# EAGLE design motion_detect (EAGLE 7.7.0)
Assembly variants: BASIC
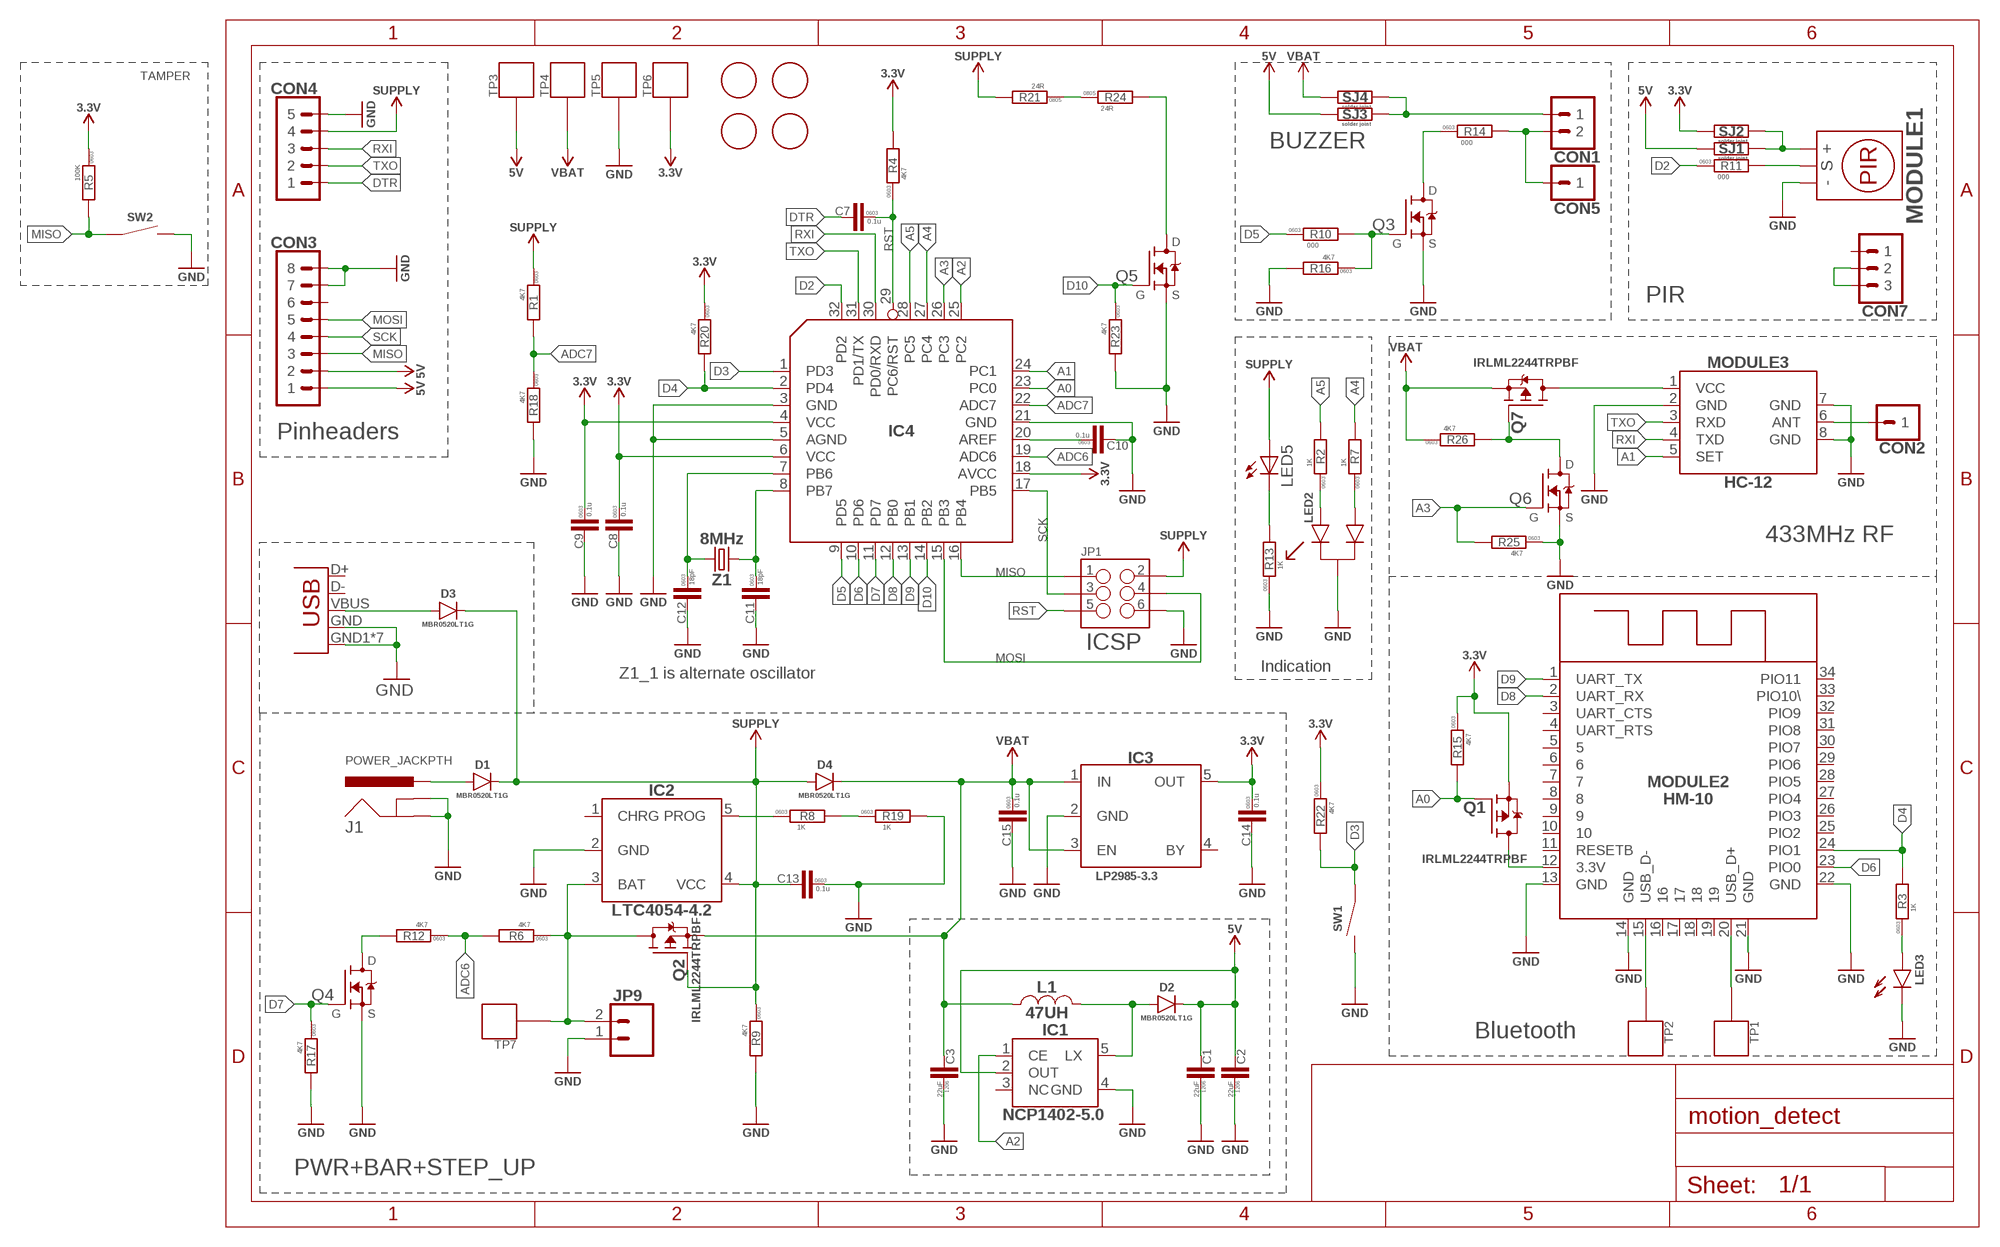
[diagram p0: schematic, sheet 1]

## Parts
C1  22uF  C-1206  [C1206]
C2  22uF  C-1206  [C1206]
C3  22uF  C-1206  [C1206]
C7  0.1u  C-0603  [C0603]
C8  0.1u  C-0603  [C0603]
C9  0.1u  C-0603  [C0603]
C10  0.1u  C-0603  [C0603]
C11  18pF  C-0603  [C0603]
C12  18pF  C-0603  [C0603]
C13  0.1u  C-0603  [C0603]
C14  0.1u  C-0603  [C0603]
C15  0.1u  C-0603  [C0603]
CON1  PINHEAD_1X02-2.54  [1X02-PTH-2.54]
CON2  PINHEAD_1X01-2.54  [1X01-PTH-2.54]
CON3  PINHEAD_1X08-2.54  [1X08-PTH-2.54]
CON4  PINHEAD_1X05-2.54  [1X05-PTH-2.54]
CON5  PINHEAD_1X01-2.54  [1X01-PTH-2.54]
CON7  PINHEAD_1X03-2.54  [1X03-PTH-2.54]
CON8  USB-1  [MICRO_USB_WITH_PEGS]
D1  MBR0520L-SOD123  [SOD123]
D2  MBR0520L-SOD123  [SOD123]
D3  MBR0520L-SOD123  [SOD123]
D4  MBR0520L-SOD123  [SOD123]
IC1  5.0  NCP1402-5V  [SOT23-5]
IC2  LTC4054  [SOT23-5L]
IC3  3.3  LP2985-3.3V  [SOT23-5L]
IC4  ATMEGA168-TQFP32  [TQFP32-08]
J1  POWER_JACKPTH  [POWER_JACK_PTH]
JP1  M03X2POGO_PINS  [2X3_POGO]
JP9  M02-B2B-PH-K-S  [JST-2-PTH]
L1  47UH  INDUCTOR-SDR0403  [SDR0403]
LED2  BL-L315EGW  [BL-L315]
LED3  LED-0603  [LED0603]
LED5  LED-3MM  [LED-3MM]
MODULE1  MOTION-PIR-DYP-ME003  [MOTION-PIR-DYP-ME003]
MODULE2  HM-10  [HM-10]
MODULE3  HC12  [HC-12]
Q1  IRLML2244TRPBF  [SOT23B-3]
Q2  IRLML2244TRPBF  [SOT23B-3]
Q3  IRLML2502-SOT23  [SOT23B-3]
Q4  IRLML2502-SOT23  [SOT23B-3]
Q5  IRLML2502-SOT23  [SOT23B-3]
Q6  IRLML2502-SOT23  [SOT23B-3]
Q7  IRLML2244TRPBF  [SOT23B-3]
R1  4K7  R-0603  [R0603]
R2  1K  R-0603  [R0603]
R3  1K  R-0603  [R0603]
R4  4K7  R-0603  [R0603]
R5  100K  R-0603  [R0603]
R6  4K7  R-0603  [R0603]
R7  1K  R-0603  [R0603]
R8  1K  R-0603  [R0603]
R9  4K7  R-0603  [R0603]
R10  000  R-0603  [R0603]
R11  000  R-0603  [R0603]
R12  4K7  R-0603  [R0603]
R13  1K  R-0603  [R0603]
R14  000  R-0603  [R0603]
R15  4K7  R-0603  [R0603]
R16  4K7  R-0603  [R0603]
R17  4K7  R-0603  [R0603]
R18  4K7  R-0603  [R0603]
R19  1K  R-0603  [R0603]
R20  4K7  R-0603  [R0603]
R21  24R  R-0805  [R0805]
R22  4K7  R-0603  [R0603]
R23  4K7  R-0603  [R0603]
R24  24R  R-0805  [R0805]
R25  4K7  R-0603  [R0603]
R26  4K7  R-0603  [R0603]
SJ1  SOLDER_JOINT  [RES_0]  (not fitted in variant BASIC)
SJ2  SOLDER_JOINT  [RES_0]  (not fitted in variant BASIC)
SJ3  SOLDER_JOINT  [RES_0]  (not fitted in variant BASIC)
SJ4  SOLDER_JOINT  [RES_0]  (not fitted in variant BASIC)
SW1  TACT_SWITCH-TC-206  [TC-0206]
SW2  TACT_SWITCH  [FSM8JH]
TP1  PAD.05  [PAD.05X.05]  (not fitted in variant BASIC)
TP2  PAD.05  [PAD.05X.05]  (not fitted in variant BASIC)
TP3  PAD.05  [PAD.05X.05]  (not fitted in variant BASIC)
TP4  PAD.05  [PAD.05X.05]  (not fitted in variant BASIC)
TP5  PAD.05  [PAD.05X.05]  (not fitted in variant BASIC)
TP6  PAD.05  [PAD.05X.05]  (not fitted in variant BASIC)
TP7  PAD.05  [PAD.05X.05]  (not fitted in variant BASIC)
U$3  FIDUCIALMOUNT  [FIDUCIA-MOUNT]  (not fitted in variant BASIC)
U$4  FIDUCIALMOUNT  [FIDUCIA-MOUNT]  (not fitted in variant BASIC)
U$5  FIDUCIALMOUNT  [FIDUCIA-MOUNT]  (not fitted in variant BASIC)
U$6  FIDUCIALMOUNT  [FIDUCIA-MOUNT]  (not fitted in variant BASIC)
Z1  8MHz  CRYSTAL-8MHZHC49UP  [HC49UP]

## Nets
A0: IC4.23(PC0) Q1.1(G) R15.2
A1: IC4.24(PC1) MODULE3.5(SET)
A2: IC1.1(CE) IC4.25(PC2)
A3: IC4.26(PC3) Q6.1(G) R25.2
A4: IC4.27(PC4) R7.2
A5: IC4.28(PC5) R2.2
ADC6: IC4.19(ADC6) R6.2 R12.1
ADC7: IC4.22(ADC7) R1.2 R18.1
ANT: CON2.1 MODULE3.6(ANT)
BAT+: IC2.3(BAT) JP9.2 Q2.3(D) R6.1 TP7.P$1
D2: IC4.32(PD2) R11.1
D3: IC4.1(PD3) R22.2 SW1.1
D4: IC4.2(PD4) MODULE2.24(PIO1) R3.2 R20.2
D5: IC4.9(PD5) R10.1
D6: IC4.10(PD6) MODULE2.23(PIO0)
D7: IC4.11(PD7) Q4.1(G) R17.1
D8: IC4.12(PB0) MODULE2.2(UART_RX)
D9: IC4.13(PB1) MODULE2.1(UART_TX)
D10: IC4.14(PB2) Q5.1(G) R23.1
DTR: C7.2 CON4.1
GND: C1.P$1 C2.P$1 C3.P$1 C8.2 C9.2 C10.2 C11.2 C12.2 C13.1 C14.2 C15.2 CON3.7 CON3.8 CON4.5 CON8.GND CON8.GND1(SHIELD) CON8.GND2(SHIELD) CON8.GND3(SHIELD) CON8.GND4(SHIELD) CON8.ID(SHIELD) CON8.P$1(SHIELD) CON8.P$2(SHIELD) IC1.4(GND) IC2.2(GND) IC3.2(GND) IC4.3(GND) IC4.5(AGND) IC4.21(GND) J1.GND J1.GNDBREAK JP1.P$6 JP9.1 LED2.C LED3.C MODULE1.1(GND) MODULE2.13(GND) MODULE2.14(GND) MODULE2.21(GND) MODULE2.22(GND) MODULE3.2(GND) MODULE3.7(GND) MODULE3.8(GND) Q3.2(S) Q4.2(S) Q5.2(S) Q6.2(S) R9.2 R13.1 R16.2 R17.2 R18.2 R19.2 R23.2 R25.1 SW1.2 SW2.3 SW2.4 TP5.P$1
MISO: CON3.3 IC4.16(PB4) JP1.P$1 R5.2 SW2.1 SW2.2
MOSI: CON3.5 IC4.15(PB3) JP1.P$4
N$1: MODULE2.12(3.3V) Q1.3(D)
N$2: LED2.AG(A) R2.1
N$3: LED3.A R3.1
N$4: C10.1 IC4.20(AREF)
N$5: D2.A IC1.5(LX) L1.P$2
N$6: C12.1 IC4.7(PB6) Z1.2
N$7: R8.2 R19.1
N$8: C11.1 IC4.8(PB7) Z1.1
N$9: IC2.5(PROG) R8.1
N$10: CON8.VBUS D3.A
N$11: MODULE1.2(OUT) R11.2
N$12: LED5.K(C) R13.2
N$13: D1.A J1.PWR
N$14: CON7.2 CON7.3
N$15: Q3.1(G) R10.2 R16.1
N$16: MODULE2.15(USB_D-) TP2.P$1
N$17: MODULE1.3(VCC) SJ1.2 SJ2.2
N$18: MODULE2.20(USB_D+) TP1.P$1
N$19: R21.1 R24.1
N$20: Q3.3(D) R14.1
N$21: Q4.3(D) R12.2
N$22: CON1.1 SJ3.2 SJ4.2
N$23: CON1.2 CON5.1 R14.2
N$24: MODULE3.1(VCC) Q7.3(D)
N$25: Q5.3(D) R24.2
N$26: LED2.AR(A1) R7.1
N$27: Q6.3(D) Q7.1(G) R26.2
RST: C7.1 IC4.29(PC6/RST) JP1.P$5 R4.1
RXI: CON4.3 IC4.30(PD0/RXD) MODULE3.4(TXD)
SCK: CON3.4 IC4.17(PB5) JP1.P$3
SUP: C13.2 CON4.4 D1.C D3.C D4.A IC2.4(VCC) JP1.P$2 LED5.A Q2.1(G) R1.1 R9.1 R21.2 ; supply symbol labelled SUPPLY
TXO: CON4.2 IC4.31(PD1/TX) MODULE3.3(RXD)
VBAT: C3.P$2 C15.1 D4.C IC3.1(IN) IC3.3(EN) L1.P$1 Q2.2(S) Q7.2(S) R26.1 SJ4.1 TP4.P$1
VDD_3V3: C8.1 C9.1 C14.1 IC3.5(OUT) IC4.4(VCC) IC4.6(VCC) IC4.18(AVCC) Q1.2(S) R4.2 R5.1 R15.1 R20.1 R22.1 SJ2.1 TP6.P$1 ; supply symbol labelled 3.3V
VDD_5V: C1.P$2 C2.P$2 CON3.1 CON3.2 D2.C IC1.2(OUT) SJ1.1 SJ3.1 TP3.P$1 ; supply symbol labelled 5V
Unconnected: CON3.6 CON7.1 CON8.D+ CON8.D- IC1.3(NC) IC2.1(CHRG) IC3.4(BY) MODULE2.3(UART_CTS) MODULE2.4(UART_RTS) MODULE2.5 MODULE2.6 MODULE2.7 MODULE2.8 MODULE2.9 MODULE2.10 MODULE2.11(RESETB) MODULE2.16 MODULE2.17 MODULE2.18 MODULE2.19 MODULE2.25(PIO2) MODULE2.26(PIO3) MODULE2.27(PIO4) MODULE2.28(PIO5) MODULE2.29(PIO6) MODULE2.30(PIO7) MODULE2.31(PIO8) MODULE2.32(PIO9) MODULE2.33(PIO10\) MODULE2.34(PIO11)

## Notes on the sheet
- TAMPER
- BUZZER
- PIR
- Pinheaders
- 433MHz RF
- ICSP
- Indication
- Z1_1 is alternate oscillator
- Bluetooth
- PWR+BAR+STEP_UP

## Library data of the parts
C1-C3 = rc:C; PACKAGE: 1206
C7-C15 = rc:C; PACKAGE: 0603
CON1 = pinhead:PINHEAD_1X02: pinheader 2P
CON2 CON5 = pinhead:PINHEAD_1X01: pinheader 1P; BOM: EXCLUDE
CON3 = pinhead:PINHEAD_1X08: pinheader 8P
CON4 = pinhead:PINHEAD_1X05: pinheader 5P
CON7 = pinhead:PINHEAD_1X03: pinheader 3P
CON8 = led_matrix_master_lib:USB: Connector Receptacle USB - micro B 2.0 5 Position; DIGIKEY#: 609-4616-1-ND; LINK: https://www.compel.ru/infosheet/TE/2013499-1; MANF: FCI; MANF#: 10118193-0001LF
D1-D4 = motion_detect_masterlib:MBR0520L: DIODE SCHOTTKY 20V 500MA SOD123; DIGIKEY#: MBR0520LT1GOSTR-ND; MANF: ON Semiconductor; MANF#: MBR0520LT1G
IC1 = motion_detect_masterlib:NCP1402: IC REG BOOST 5V 0.13A 5TSOP; DIGIKEY#: NCP1402SN50T1GOSCT-ND; LINK: https://www.chipdip.ru/product/ncp1402sn50t1g; MANF: ON Semiconductor; MANF#: NCP1402SN50T1G
IC2 = gradus_mater_lib:LTC4054: IC CHARG BATTERY L-ION TSOT23-5; DIGIKEY#: LTC4054LES5-4.2#TRPBFCT-ND; MANF: Linear Technology; MANF#: LTC4054LES5-4.2#TRPBF
IC3 = motion_detect_masterlib:LP2985-3.3V: IC REG LDO 3.3V 0.15A SOT23-5; DIGIKEY#: 296-18476-1-ND; MANF: Texas Instruments; MANF#: LP2985-33DBVR
IC4 = motion_detect_masterlib:ATMEGA168; MANF#: ATMEGA168
J1 = SparkFun-Connectors:POWER_JACK: Power Jack This is the standard 5.5mm barrel jack for power. The PTH is the most common, proven, reliable, footprint. The Slot footprint only works if the mill layer is transmitted to the PCB fab house so be warned. Spark Fun Electronics SKU : PRT-00119 SMT: CONN-08106 Mating wall wart : TOL-00298 (and others)
JP1 = SparkFun-Connectors:M03X2: 2x3 .1" header. Shrouded, with keying- CONN-10681 SMT- CONN-11415 Pogo pins- HW-11044; PROD_ID: HW-11044
JP9 = ExitControl_v2_master_library:M02: Header 2 Standard 2-pin 0.1" header. Use with straight break away headers (SKU : PRT-00116), right angle break away headers (PRT-00553), swiss pins (PRT-00743), machine pins (PRT-00117), and female headers (PRT-00115). Molex polarized connector foot print use with SKU : PRT-08233 with associated crimp pins and housings.; COMPEL: http://www.compel.ru/infosheet/JST/B2B-PH-K-S%5BLF%5D%5BSN%5D/; DIGIKEY#: 455-1704-ND; MANF: B2B-PH-K-S(LF)(SN); MANF#: JST Sales America Inc
L1 = motion_detect_masterlib:INDUCTOR: Unshielded Wirewound Inductor; LINK: https://www.chipdip.ru/product/sdr0403-470k
LED2 = motion_detect_masterlib:BL-L315EGW
LED3 = rc:LED: SMD LED; ASSY: DNM; COLOR: blue
LED5 = dp_devices:LED: Light Emitting Diode; COLOR: RED
MODULE1 = diy-modules:MOTION-PIR-DYP-ME003: PIR Motion Sensor Module DYP-ME003 based on BISS0001 pyroelectic detector Click here to find device on ebay.com <http://www.ebay.com/sch/dyp+me003>
MODULE2 = motion_detect_masterlib:HM-10
MODULE3 = motion_detect_masterlib:HC12
Q1 Q2 Q7 = motion_detect_masterlib:IRLML2244TRPBF: MOSFET P-CH 20V 4.3A SOT23; DIGIKEY#: IRLML2244TRPBFCT-ND; LINK: https://www.chipdip.ru/product/irlml2244trpbf; MANF: Infineon Technologies; MANF#: IRLML2244TRPBF
Q3-Q6 = motion_detect_masterlib:IRLML2502: MOSFET N-CH 20V 4.2A SOT-23; DIGIKEY#: IRLML2502PBFTR-ND; MANF: Infineon Technologies; MANF#: IRLML2502TRPBF
R1 R2 R6-R19 R23 R25 R26 = rc:R; PACKAGE: 0603
R3-R5 R20 R22 = rc:R; ASSY: DNM; PACKAGE: 0603
R21 R24 = rc:R; PACKAGE: 0805
SJ1-SJ4 = eth_conv_master_lib:SOLDER_JOINT; ASSY: DNM; BOM: EXCLUDE
SW1 SW2 = motion_detect_masterlib:TACT_SWITCH
TP1-TP7 = pixhawk2:PAD: Test pad This footprint includes three classes: The actual test pads, a pogo-pin footprint to mount the pogo-pin as through-hole part and a hole footprint which allows the head of the pogo-pin to pass through (do NOT use the hole to mount the pogo-pin). In a typical test setup, the stack would consist of three PCBs: The actual PCB under testing with a test pad on the bottom, then a second PCB with the hole for the pogo-pin head where the PCB under testing is pressed on and a third PCB at 30 mm / 1.2" distance with the pogo-pin footprints. The pogo-pins are soldered to the last PCB. To create the stack, copy the board under testing and exchange the footprints - this way the correct positioning is ensured.; BOM: EXCLUDE; PARTNO: *
U$3-U$6 = eth_conv_master_lib:FIDUCIALMOUNT; BOM: EXCLUDE
Z1 = ExitControl_v2_master_library:CRYSTAL-8MHZ: Crystal 8.0000MHz 30ppm 18pF 40 Ohm -20°C - 70°C Surface Mount HC49/US; DIGIKEY#: 535-10212-1-ND; MANF: Abracon LLC; MANF#: ABLS-8.000MHZ-B4-T

## Net classes
1 vcc: width 0.254 mm

## Board
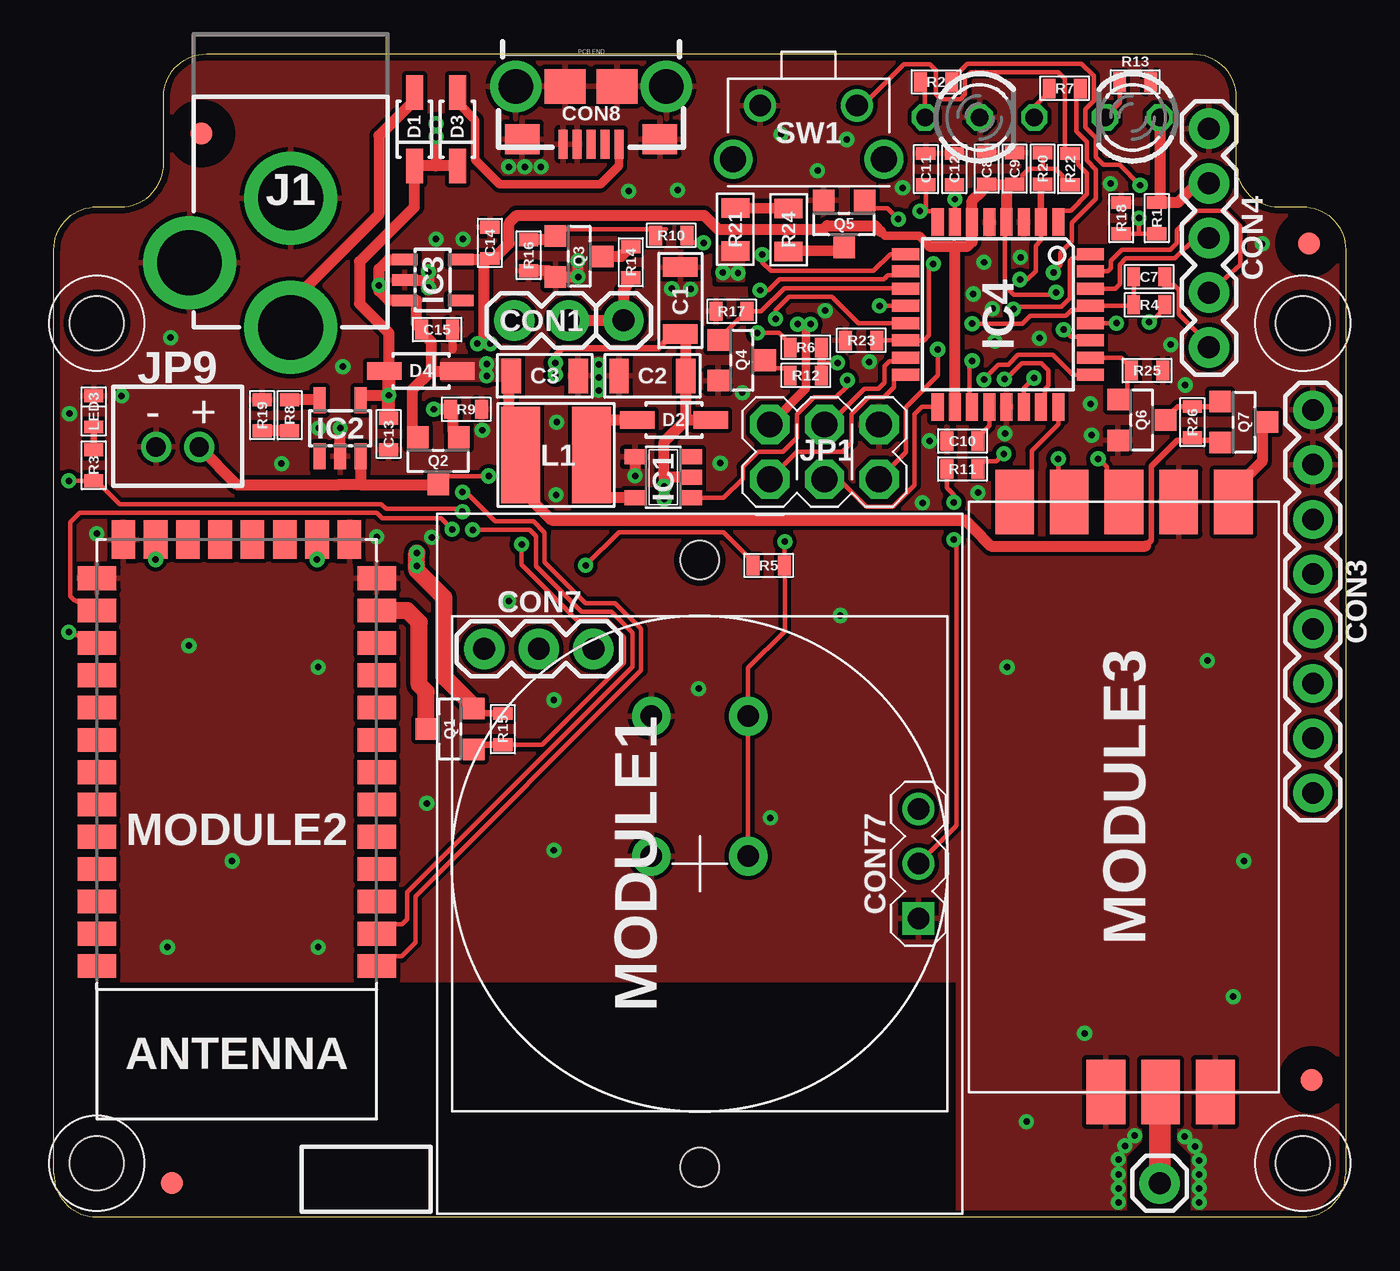
[diagram p1: board, top side]
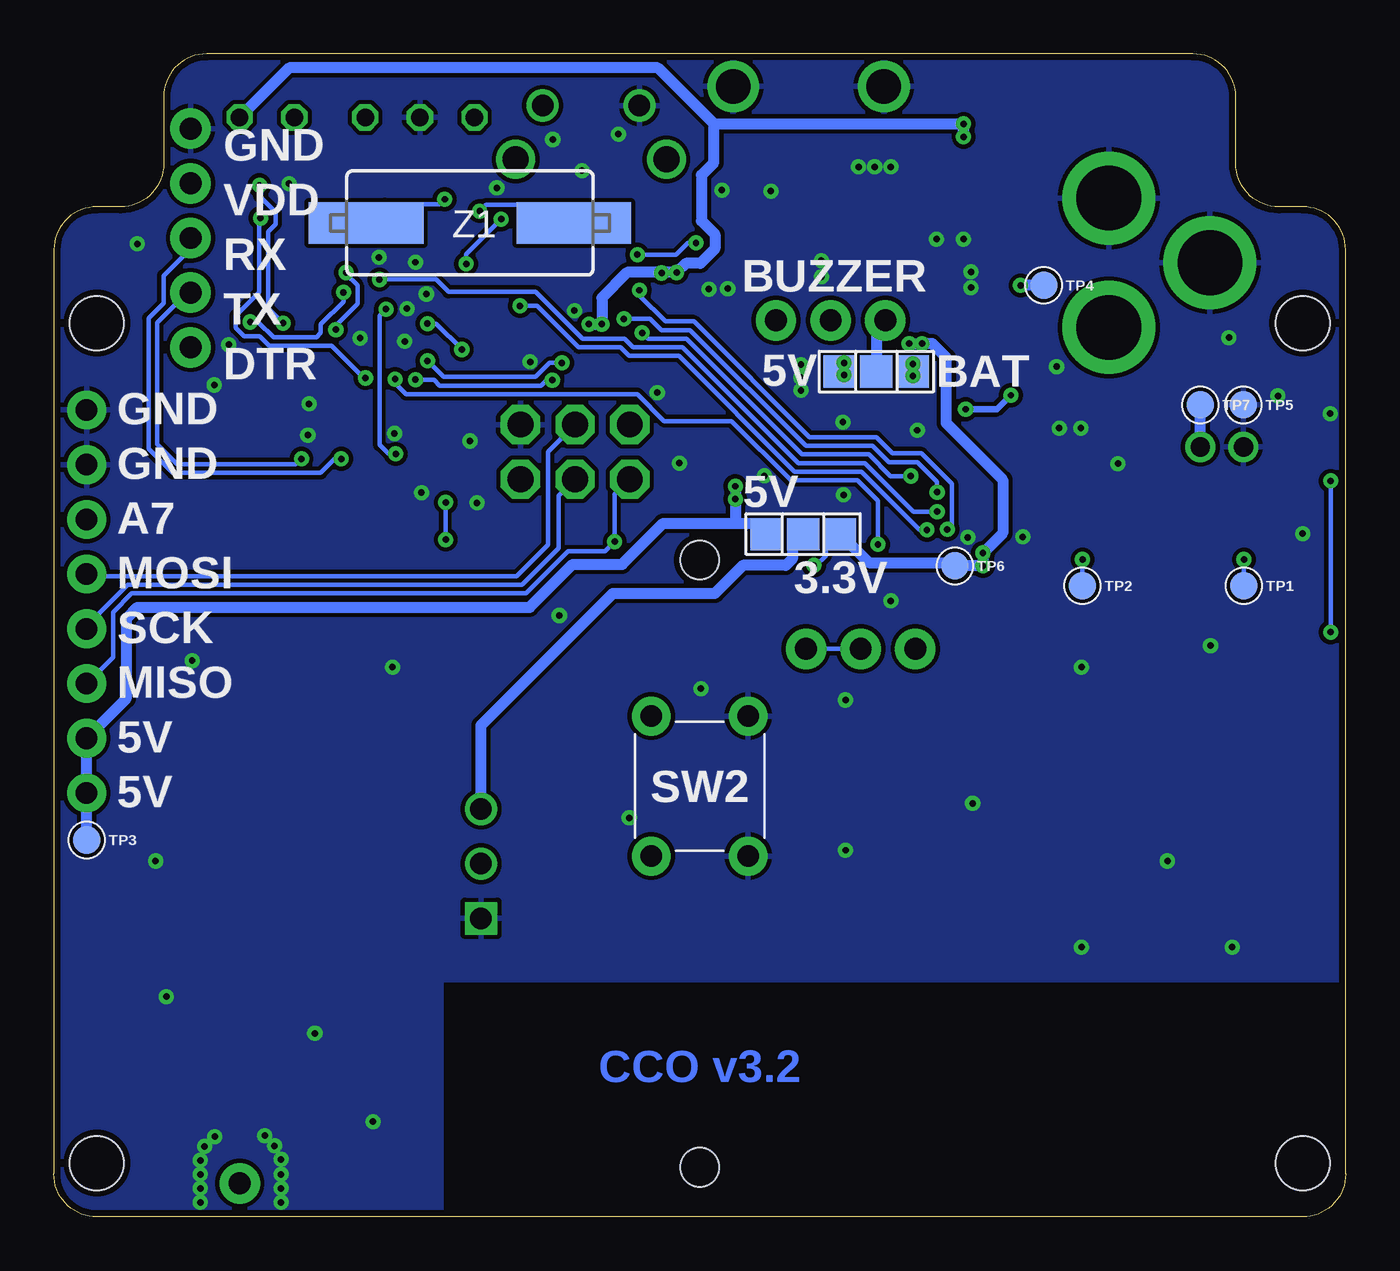
[diagram p2: board, bottom side, seen from below]

Size 60 x 54 mm. Coordinates in mm from the lower left corner, seen from the top.
Copper layers (1*16): Top 0.035mm / dielectric 0.5mm / Bottom 0.035mm
Design rules "design_rules *": minimum track width 0.2mm, minimum drill 0.2mm, track to track 0.2mm, track to pad 0.2mm, pad to pad 0.2mm, via to via 0.2mm, smd to smd 0.15mm, copper to edge 0.3mm, drill to drill 0.2mm, minimum pad ring 0.125mm, minimum via ring 0.125mm, stop-mask expansion 1mil, vias tented up to drill 0.31mm, thermal gap 8mil
tRestrict: 8 lines

### Footprints (pad centres in the part's own frame; a part is rotated, then mirrored left to right if it is on the bottom)
C1206 = smd 0.9 x 1.6: P$1 -1.55,0; P$2 1.55,0
C0603 = smd 0.6 x 0.9: 1 -0.725,0; 2 0.725,0
1X02-PTH-2.54 = drill 1.016 pad 1.88: 1 -1.27,0; 2 1.27,0
1X01-PTH-2.54 = drill 1.016 pad 1.88: 1 0,0
1X08-PTH-2.54 = drill 1 pad 1.8: 1 -8.89,0; 2 -6.35,0; 3 -3.81,0; 4 -1.27,0; 5 1.27,0; 6 3.81,0; 7 6.35,0; 8 8.89,0
1X05-PTH-2.54 = drill 1.016 pad 1.88: 1 -5.08,0; 2 -2.54,0; 3 0,0; 4 2.54,0; 5 5.08,0
1X03-PTH-2.54 = drill 1.016 pad 1.88: 1 -2.54,0; 2 0,0; 3 2.54,0
MICRO_USB_WITH_PEGS = smd 0.4 x 1.35: D+ 0,1.44; D- -0.65,1.44; GND 1.3,1.44; ID 0.65,1.44; VBUS -1.3,1.44 | smd 1.9 x 1.6: GND1 -1.2,-1.24; GND2 1.2,-1.24 | smd 1.6 x 1.4: GND3 -3.2,1.21; GND4 3.2,1.21 | drill 1.6 pad 2: P$1 -3.5,-1.24; P$2 3.5,-1.24
SOD123 = smd 1.6 x 0.8: A 1.7,0; C -1.7,0
SOT23-5 = smd 0.7 x 1: 1 -0.95,-1.3; 2 0,-1.3; 3 0.95,-1.3; 4 0.95,1.3; 5 -0.95,1.3
SOT23-5L = smd 0.55 x 1.2: 1 -0.95,-1.3; 2 0,-1.3; 3 0.95,-1.3; 4 0.95,1.3; 5 -0.95,1.3
TQFP32-08 = smd 1.27 x 0.559: 1 -4.293,2.8; 2 -4.293,2; 3 -4.293,1.2; 4 -4.293,0.4; 5 -4.293,-0.4; 6 -4.293,-1.2; 7 -4.293,-2; 8 -4.293,-2.8; 17 4.293,-2.8; 18 4.293,-2; 19 4.293,-1.2; 20 4.293,-0.4; 21 4.293,0.4; 22 4.293,1.2; 23 4.293,2; 24 4.293,2.8 | smd 0.559 x 1.27: 9 -2.8,-4.293; 10 -2,-4.293; 11 -1.2,-4.293; 12 -0.4,-4.293; 13 0.4,-4.293; 14 1.2,-4.293; 15 2,-4.293; 16 2.8,-4.293; 25 2.8,4.293; 26 2,4.293; 27 1.2,4.293; 28 0.4,4.293; 29 -0.4,4.293; 30 -1.2,4.293; 31 -2,4.293; 32 -2.8,4.293
POWER_JACK_PTH = drill 2.997 pad 4.318: GND 0,7.7; GNDBREAK 4.7,10.7; PWR 0,13.7
2X3_POGO = drill 1.2 pad 1.829 octagon: P$1 0,0; P$2 0,2.54; P$3 2.54,0; P$4 2.54,2.54; P$5 5.08,0; P$6 5.08,2.54
JST-2-PTH = drill 0.9 pad 1.4: 1 -1,0; 2 1,0
SDR0403 = smd 1.8 x 4.5: P$1 -1.65,0; P$2 1.65,0
BL-L315 = drill 0.813 octagon: AG -2.54,0; AR 2.54,0; C 0,0
LED0603 = smd 0.6 x 0.9: A -0.725,0; C 0.725,0
LED-3MM = drill 0.813 octagon: A -1.27,0; K 1.27,0
MOTION-PIR-DYP-ME003 = drill 1 square: 1 -2.54,-10.16 | drill 1: 2 0,-10.16; 3 2.54,-10.16 | hole 1.8: -14.1,0; 14.1,0
HM-10 = smd 1.8 x 1.1: 1 -6.5,6.35; 2 -6.5,4.85; 3 -6.5,3.35; 4 -6.5,1.85; 5 -6.5,0.35; 6 -6.5,-1.15; 7 -6.5,-2.65; 8 -6.5,-4.15; 9 -6.5,-5.65; 10 -6.5,-7.15; 11 -6.5,-8.65; 12 -6.5,-10.15; 13 -6.5,-11.65; 22 6.5,-11.65; 23 6.5,-10.15; 24 6.5,-8.65; 25 6.5,-7.15; 26 6.5,-5.65; 27 6.5,-4.15; 28 6.5,-2.65; 29 6.5,-1.15; 30 6.5,0.35; 31 6.5,1.85; 32 6.5,3.35; 33 6.5,4.85; 34 6.5,6.35 | smd 1.1 x 1.8: 14 -5.23,-13.45; 15 -3.73,-13.45; 16 -2.23,-13.45; 17 -0.73,-13.45; 18 0.77,-13.45; 19 2.27,-13.45; 20 3.77,-13.45; 21 5.27,-13.45
HC-12 = smd 3 x 1.8: 1 -13.7,5.08; 2 -13.7,2.54; 3 -13.7,0; 4 -13.7,-2.54; 5 -13.7,-5.08; 6 13.7,1.7; 7 13.7,4.24; 8 13.7,-0.84
SOT23B-3 = smd 1 x 1: 1 -0.95,-1.1; 2 0.95,-1.1; 3 0,1.1
R0603 = smd 0.6 x 0.9: 1 -0.725,0; 2 0.725,0
R0805 = smd 0.9 x 1.3: 1 -1,0; 2 1,0
RES_0 = smd 1.5 x 1.5: 1 -0.85,0; 2 0.85,0
TC-0206 = drill 1: 1 -2.25,-1.25; 2 2.25,-1.25 | drill 1.2: P$3 -3.5,1.25; P$4 3.5,1.25
FSM8JH = drill 1 pad 1.8: 1 2.25,3.25; 2 2.25,-3.25; 3 -2.25,3.25; 4 -2.25,-3.25
PAD.05X.05 = smd 1.27 x 1.27: P$1 0,0
BOARD_OUTLINE = hole 2.5: -28,-23.5; 28,-23.5; -28,15.5; 28,15.5
FIDUCIA-MOUNT = smd 1.016 x 1.016: P$1 0,0
HC49UP = smd 5.334 x 1.93: 1 -4.826,0; 2 4.826,0

### Placement (x,y rotation side)
C1  29.1,42.55 270 top
C2  27.8,39.05 0 top
C3  22.8,39.05 180 top
C7  50.88,43.65 0 top
C8  43.33,48.67 90 top
C9  44.62,48.67 90 top
C10  42.2,36.02 180 top
C11  40.5,48.65 90 top
C12  41.83,48.65 90 top
C13  15.55,36.35 90 top
C14  20.25,45.23 90 top
C15  17.8,41.2 0 top
CON1  22.65,41.62 0 top
CON2  51.36,1.56 0 top
CON3  58.48,28.57 90 top
CON4  53.65,45.45 90 top
CON5  26.46,41.62 0 top
CON7  22.52,26.38 0 top
CON8  24.95,51.25 180 top
D1  16.75,50.5 90 top
D2  28.8,37 180 top
D3  18.75,50.5 90 top
D4  17.05,39.27 180 top
IC1  28.3,34.34 90 top
IC2  13.3,36.62 0 top
IC3  17.6,43.5 270 top
IC4  43.85,41.9 270 top
J1  11,55 180 top
JP1  33.25,34.25 0 top
JP9  5.75,35.75 0 top
L1  23.32,35.38 0 top
LED2  43,51.05 0 top
LED3  1.85,37.4 90 top
LED5  50.1,51.05 180 top
MODULE1  30,16.4 90 top
MODULE2  8.5,18 180 top
MODULE3  49.7,19.5 270 top
Q1  18.4,22.65 90 top
Q2  17.85,35.1 180 top
Q3  24.4,44.6 270 top
Q4  31.95,39.77 270 top
Q5  36.7,46.1 180 top
Q6  50.52,37 270 top
Q7  55.27,36.9 270 top
R1  51.23,46.38 270 top
R2  40.98,52.7 0 top
R3  1.85,34.9 270 top
R4  50.88,42.35 0 top
R5  33.2,30.25 0 top
R6  34.92,40.38 0 top
R7  46.95,52.4 0 top
R8  10.95,37.23 270 top
R9  19.15,37.5 0 top
R10  28.68,45.58 180 top
R11  42.2,34.73 180 top
R12  34.92,39.08 180 top
R13  50.23,52.7 180 top
R14  26.8,44.33 270 top
R15  20.85,22.65 270 top
R16  22.05,44.65 270 top
R17  31.48,42.05 180 top
R18  49.58,46.38 90 top
R19  9.68,37.23 90 top
R20  45.92,48.67 270 top
R21  31.65,45.85 270 top
R22  47.2,48.65 90 top
R23  37.5,40.7 180 top
R24  34.12,45.83 270 top
R25  50.77,39.3 180 top
R26  52.88,36.9 90 top
SJ1  26.05,31.7 0 bottom  (not fitted)
SJ2  24.35,31.7 180 bottom  (not fitted)
SJ3  22.65,39.25 0 bottom  (not fitted)
SJ4  20.95,39.25 180 bottom  (not fitted)
SW1  35.05,50.35 180 top
SW2  30,20 180 bottom
TP1  4.73,29.3 0 bottom  (not fitted)
TP2  12.23,29.3 0 bottom  (not fitted)
TP3  58.48,17.5 0 bottom  (not fitted)
TP4  14.03,43.25 0 bottom  (not fitted)
TP5  4.75,37.7 0 bottom  (not fitted)
TP6  18.15,30.23 0 bottom  (not fitted)
TP7  6.75,37.7 0 bottom  (not fitted)
U$1  [BOARD_OUTLINE]  30,26 0 top
U$3  6.85,50.3 0 top  (not fitted)
U$4  58.3,45.2 0 top  (not fitted)
U$5  58.42,6.35 0 top  (not fitted)
U$6  5.48,1.57 0 top  (not fitted)
Z1  40.67,46.15 180 bottom

### Tracks (layer width: path | path; a pad name or v marks a point on that pad's centre or on a via)
A0  (via drill 0.3 pad 0.7)
  Top 0.2: R15.2 22.68,21.93 26.48,25.73 26.48,26.93 25.7,27.7 24.3,27.7 21.73,30.27 v21.73,31.23 | IC4.23 46.02,37.78 46.02,38.42 46.2,38.6 46.2,39.3 45.88,39.62 44.95,39.62 44.23,38.9 v44.15,38.9
  Top 0.3: Q1.1 19.73,21.93 R15.2
  Bottom 0.2: v21.73,31.23 21.73,33.25 22.68,34.2 25.77,34.2 28.52,36.95 31.65,36.95 32.9,38.2 43.65,38.2 44.15,38.7 v44.15,38.9
A1
  Top 0.2: MODULE3.5 44.62,33.87 45.42,34.67 45.42,35.58 46.65,36.8 IC4.24
A2  (via drill 0.3 pad 0.7)
  Top 0.2: 48.62,39.1 IC4.25 47.33,39.1 46.4,40.02 44.77,40.02 44.33,39.58 43.88,39.58 43.2,38.9 v43.2,38.88 | IC1.1 31.11,33.38 32,34.27 32,34.83 32.7,35.52 33.88,35.52 34.52,36.17 34.52,37.27 35.3,38.05 36.33,38.05 36.85,38.58 v36.85,38.85
  Bottom 0.2: v43.2,38.88 42.35,38.88 42.08,38.6 37.38,38.6 37.12,38.85 v36.85,38.85
A3
  Top 0.2: IC4.26 49.58,39.9 50.05,39.42 R25.2 49.85,39.3 49.85,38.38 Q6.1
A4  (via drill 0.3 pad 0.7)
  Top 0.2: IC4.27 47.97,40.88 47.23,40.88 v46.9,41.2 | v46.42,43.85 46.75,44.17 46.75,44.77 47.27,45.3 47.27,46.15 48.4,47.27 48.4,48.62 47.98,49.05 47.98,49.92 47.5,50.4 47.5,52.4 R7.2 47.75,52.33
  Bottom 0.2: v46.42,43.85 46.42,43.77 45.9,43.25 45.9,42.4 46.9,41.4 v46.9,41.2
A5  (via drill 0.3 pad 0.7)
  Top 0.2: IC4.28 v49.35,41.5 | v50.45,47.9 49.5,48.85 48.75,48.85 48.4,49.2 48.4,50.1 47.9,50.6 47.9,51.42 48.3,51.83 48.3,52.98 47.73,53.55 42.42,53.55 41.7,52.83 R2.2
  Bottom 0.2: v49.35,41.5 50.05,42.2 50.05,45.75 49.7,46.1 49.7,46.65 50.45,47.4 v50.45,47.9
ADC6  (via drill 0.3 pad 0.7)
  Top 0.2: v36.4,39.65 35.65,39.65 | IC4.19 42.52,37.73 42.52,39.75 v42.65,39.75
  Top 0.4: R12.1 35.65,39.65 R6.2
  Bottom 0.2: v42.65,39.75 41.9,39 37.62,39 36.98,39.65 v36.4,39.65
ADC7  (via drill 0.3 pad 0.7)
  Top 0.2: R1.2 50.4,45.65 | 50.4,45.65 R18.1 | 50.4,45.65 v50.4,46.38 | v45.52,38.95 45.05,38.48 IC4.22
  Bottom 0.2: v50.4,46.38 50.48,46.38 50.48,42.92 51.55,41.85 51.55,41.27 51.16,40.89 51.15,40.9 50.45,40.9 50,40.45 47.1,40.45 45.6,38.95 v45.52,38.95
ANT
  Top 1: CON2.1 51.36,5.76 MODULE3.6
BAT+  (via drill 0.3 pad 0.7)
  Top 0.2: Q2.3 18.25,34.4 v20.2,34.4 | R6.1 34.2,40.55 34.05,40.7 34.02,40.7 33.67,41.05 v32.67,41.05
  Top 0.5: JP9.2 8.5,34 13.25,34 14.25,34 | 14.25,34 Q2.3 | IC2.3 14.25,34
  Bottom 0.2: v20.2,34.4 21.15,34.4 22.15,35.4 25.25,35.4 30.62,40.77 32.4,40.77 v32.67,41.05
  Bottom 0.5: JP9.2 TP7.P$1
D2  (via drill 0.3 pad 0.7)
  Top 0.2: IC4.32 47.97,44.52 47.33,44.52 47.2,44.4 47.2,42.65 46.8,42.25 44.73,42.25 v44.58,42.15 | R11.1 42.92,35.08 43.77,35.08 v44.12,35.42
  Bottom 0.2: v44.58,42.15 44.88,41.85 44.88,35.85 44.45,35.42 v44.12,35.42
D3
  Top 0.2: 46.73,46.27 IC4.1 46.65,46.48 46.9,46.73 47.23,46.73 47.98,47.48 47.98,48.45 47.55,48.88 47.55,49.38 R22.2 47.1,49.38 46.95,49.52 46.95,52.85 46.65,53.15 42.6,53.15 42.33,52.88 42.33,52.12 42.1,51.9 41.2,51.9 40.98,52.12 40.98,53.25 40.7,53.52 39.48,53.52 37.55,51.6 SW1.1
D4  (via drill 0.3 pad 0.7)
  Top 0.2: v44.88,43.52 45.23,43.52 45.6,43.9 45.6,45.1 45.85,45.35 IC4.2 | 1.7,34.17 R3.2 | MODULE2.24 v0.7,27.15 | R3.2 v0.7,34.17 | v18.98,32.75 18.85,32.88 15.43,32.88 15.2,33.1 3.05,33.1 1.98,34.17 R3.2
  Top 0.3: IC4.2 45.85,47.95 R20.2
  Bottom 0.2: v0.7,27.15 v0.7,34.17 | v18.98,32.75 20.07,32.75 22.32,35 25.43,35 30.8,40.38 33.1,40.38 33.5,40.77 35.45,40.77 37.62,42.95 41.67,42.95 42.25,43.52 v44.88,43.52
D5  (via drill 0.3 pad 0.7)
  Top 0.2: 39.56,44.88 IC4.9 38.85,44.7 38.08,43.92 33.3,43.92 32.9,44.33 v32.9,44.67 | v30.18,45.23 29.4,45.23 R10.1
  Bottom 0.2: v32.9,44.67 31.1,44.67 30.55,45.23 v30.18,45.23
D6  (via drill 0.3 pad 0.7)
  Top 0.2: MODULE2.23 0.93,28.65 0.75,28.82 0.75,32.25 1.2,32.7 15,32.7 15.25,32.45 17.98,32.45 v18.5,31.93 | 33.1,43.02 v32.8,43.02 33.2,43.02 33.7,43.52 38.55,43.52 38.75,43.73 39.38,43.73 IC4.10
  Bottom 0.2: v18.5,31.93 18.3,32.12 18.3,34.05 19.7,35.45 21.05,35.45 21.8,36.2 24.9,36.2 30.27,41.58 31.6,41.58 32.8,42.77 v32.8,43.02
D7
  Top 0.2: IC4.11 39.38,42.92 | Q4.1 31.82,41.7 32.2,41.7 R17.1 32.85,42.05 33.92,43.12 39.53,43.12 IC4.11 | 39.56,43.27 IC4.11
D8  (via drill 0.3 pad 0.7)
  Top 0.2: IC4.12 v38.35,42.3 | v19.45,31.9 22.1,31.9 22.4,31.6 22.4,30.2 24.5,28.1 25.9,28.1 26.88,27.12 26.88,25.55 16.4,15.07 16.4,13.82 16.18,13.6 15.7,13.6 15.25,13.15 MODULE2.2
  Bottom 0.2: v38.35,42.3 37.55,42.3 35.62,40.38 33.67,40.38 33.27,39.98 30.98,39.98 25.6,34.6 22.5,34.6 19.8,31.9 v19.45,31.9
D9  (via drill 0.3 pad 0.7)
  Top 0.2: 39.38,41.67 IC4.13 37.38,41.5 36.15,42.73 34.15,42.73 33.52,42.1 v33.52,41.7 | v18.98,33.65 19.15,33.65 20.5,32.3 22.27,32.3 22.8,31.77 22.8,30.4 24.7,28.5 26.07,28.5 27.27,27.3 27.27,25.38 16.8,14.9 16.8,12.75 16.15,12.1 15.75,12.1 15.3,11.65 MODULE2.1
  Bottom 0.2: v33.52,41.7 32.3,41.7 31.77,41.17 30.45,41.17 25.07,35.8 21.98,35.8 21.23,35.05 19.9,35.05 18.98,34.12 v18.98,33.65
D10  (via drill 0.3 pad 0.7)
  Top 0.2: v40.85,44.25 40.65,44.05 40.65,40.92 40.42,40.7 IC4.14 R23.1 | Q5.1 38.02,46.83 38.73,46.83 v39.23,46.33
  Bottom 0.2: v39.23,46.33 40.85,44.7 v40.85,44.25
DTR
  Top 0.2: C7.2 51.52,43.25 52.05,43.25 52.25,43.05 52.25,41.92 53.65,40.52 CON4.1
GND  (via drill 0.3 pad 0.7)
  Top 0.2: 41.6,49.38 C12.2
  Top 0.4: C15.2 18.52,40.27 | 23.67,49.98 CON8.GND
  Top 0.5: IC1.4 v27,34.41 | IC3.2 17.4,43.5 v17.4,43.88 v17.4,43.15 | IC2.2 v13.3,36.62 | C2.P$1 26.25,39.52 | R16.2 23.02,43.92 Q3.2 v24.35,43.65 v24.35,44.4 | 19.9,37.48 R9.2 | MODULE2.21 3.23,31.73
  other vias: 25.3,39.58 25.3,38.98 25.3,38.38 19.9,36.52 44.9,44.55 2,31.73 31.98,38.27 3.15,38.12 40.67,36.02 28.7,43.1 29.57,43.08 21.12,48.75 21.88,48.75 17.75,45.4 53.58,25.82 55.27,16.52 47.88,8.52 45.17,4.43 54.77,10.22 33.27,18.52 21.12,28.6 8.27,16.52 5.27,12.53 12.27,12.53 12.27,25.52 6.27,26.52 36.52,27.93 44.27,25.52 50.2,3.77 53.2,0.68 49.75,3.3 49.45,2.68 49.45,1.98 49.45,1.32 49.45,0.68 53.2,1.32 53.2,1.98 53.2,2.62 53,3.27 52.52,3.73 17.55,31.55 5.43,40.83 0.73,37.3 19,45.4 15,31.57 23.32,33.52 23.35,36.9 30.95,35 40.35,33.15 56.12,45.17 35.83,42.08 43.6,42.17 43.7,40.65 45.77,40.8 42.7,42.85 42.92,33.62 28.98,47.67 22.62,48.75 36.83,50.02 43.2,44.33 39.42,47.77 49.08,47.98 37.88,39.7 44.17,36.38 17.32,19.2 23.23,24 23.23,17.02 29.95,24.52 26.7,47.62 48.2,36.3 52.55,38.62 51.88,40.5 48.15,37.75 35.48,48.58 33.77,50.27 12.3,36.62 10.57,34.98 13.43,39.48
  pour Bottom (rank 3): 60,0 42,0 42,11 0,11 0,54 60,54
  pour Top: 26.6,38.1 26.6,40 24,40 24,38.1
  pour Top (rank 3): 60,0 42,0 42,11 0,11 0,54 60,54
MISO  (via drill 0.3 pad 0.7)
  Top 0.2: JP1.P$1 34.52,35.52 36.62,35.52 37.05,35.95 37.05,37.27 37.83,38.05 38.55,38.05 39.02,38.52 39.02,39.1 IC4.16 39.56,38.92 | v33.95,31.35 33.92,31.35 R5.2 33.95,29 33.95,27.2 32.25,25.5 SW2.2 SW2.1
  Bottom 0.2: CON3.3 57.25,25.99 57.25,28.07 56.38,28.95 38.08,28.95 36.12,30.9 34.4,30.9 v33.95,31.35 33.95,33.55 JP1.P$1
MOSI
  Top 0.2: 39.38,39.73 IC4.15 39.56,39.73 38.8,39.73 38.58,39.5 38.58,38.73 38.3,38.45 37.65,38.45 36.02,36.81 35.79,36.81 JP1.P$4
  Bottom 0.2: JP1.P$4 37.05,35.53 37.05,31.2 38.5,29.75 58.48,29.75 CON3.5
N$1
  Top 0.8: Q1.3 17.3,24.38 16.98,24.7 16.98,27.6 16.43,28.15 MODULE2.12
N$2
  Top 0.2: R2.1 40.46,52.49 LED2.AG
N$3
  Top 0.3: R3.1 LED3.A
N$4
  Top 0.2: 42.98,36.05 C10.1 42.92,36.2 43.45,36.73 IC4.20
N$5
  Top 0.406: 24.85,33.38 24.98,33.38 L1.P$2 25.3,35.38 25.3,37
  Top 0.5: D2.A 25.3,37 24.85,37 | IC1.5 24.85,33.38
N$6  (via drill 0.3 pad 0.7)
  Top 0.2: 41.85,47.92 C12.1 | 41.73,47.92 C12.1 | IC4.7 v41.85,47.25 41.85,47.9 C12.1
  Bottom 0.2: Z1.2 44.63,47.02 42.08,47.02 v41.85,47.25
N$7
  Top 0.5: R8.2 R19.1
N$8  (via drill 0.3 pad 0.7)
  Top 0.2: IC4.8 41.05,46.7 40.5,46.7 | C11.1 40.5,46.7 | 40.5,46.7 v40.23,46.7
  Bottom 0.2: Z1.1 36.4,46.7 36.4,47 39.92,47 v40.23,46.7
N$9
  Top 0.2: IC2.5 12.32,37.95
  Top 0.5: 12.32,37.95 R8.1
N$10
  Top 0.4: D3.A 18.75,51.75 19.57,50.92 19.57,49.08 20.7,47.95 25.4,47.95 26.25,48.8 CON8.VBUS
N$11  (via drill 0.3 pad 0.7)
  Top 0.2: MODULE1.2 41.92,18.16 41.92,31.32 v41.8,31.45 | v41.8,33.17 41.8,33.52 41.48,33.85 R11.2
  Bottom 0.2: v41.8,31.45 v41.8,33.17
N$12
  Top 0.2: R13.2 49.5,51.72 LED5.K
N$13
  Top 0.5: D1.A 16.75,51.85 15.1,50.2 15.1,46.55 11,42.45 J1.PWR
N$14
  Bottom 0.2: CON7.3 CON7.2
N$15
  Top 0.2: Q3.1 23.3,45.85 28.43,45.85 R10.2
  Top 0.5: Q3.1 23.12,45.38 R16.1
N$16  (via drill 0.3 pad 0.7)
  Top 0.2: MODULE2.15 12.23,30.55 v12.23,30.52
  Bottom 0.2: TP2.P$1 v12.23,30.52
N$17
  Bottom 0.3: SJ2.2
  Bottom 0.5: MODULE1.3 40.16,22.82 34.03,28.95 29.3,28.95 28,30.25 26,30.25 25.7,30.55 25.7,31.7 SJ2.2
N$18  (via drill 0.3 pad 0.7)
  Top 0.2: MODULE2.20 v4.73,30.53 v4.73,30.52
  Bottom 0.2: v4.73,30.52 TP1.P$1
N$19
  Top 0.5: R21.1 R24.1
N$20
  Top 0.5: Q3.3 26.35,44.6 R14.1
N$21
  Top 0.2: Q4.3 33.33,39.4 34.2,39.4 R12.2
N$22
  Bottom 0.5: CON1.1 21.8,41.2 SJ4.2
N$23
  Top 0.5: CON1.2 CON5.1 26.46,42.94 26.45,42.95 26.45,43 R14.2
N$24
  Top 0.5: Q7.3 56.12,36.65 56.12,35.08 54.78,33.73 MODULE3.1
N$25
  Top 0.5: 36.7,44.75 Q5.3 36.7,45.25 36.3,44.85 R24.2
N$26
  Top 0.2: R7.1 46.23,52.23 45.54,51.54 LED2.AR
N$27
  Top 0.25: Q7.1 54.17,37.62 R26.2 52.2,37.62 51.95,37.38 51.95,37.33 Q6.3
RST  (via drill 0.3 pad 0.7)
  Top 0.2: JP1.P$5 39.58,35.49 39.58,37.6 41.05,39.08 v41.05,40.27 | C7.1 R4.1 50.1,42.3 IC4.29 48.14,42.12 47.27,42.12 47,41.85 45.35,41.85 44.98,41.48 v42.65,41.48
  Bottom 0.2: v41.05,40.27 42.25,41.48 v42.65,41.48
RXI  (via drill 0.3 pad 0.7)
  Top 0.2: MODULE3.4 46.65,33.2 v46.65,35.2 | IC4.30 49.3,43.1 49.5,43.3 49.5,44.2 49.8,44.5 52.08,44.5 53.02,45.45 CON4.3
  Bottom 0.2: v46.65,35.2 46.95,35.2 47.6,34.55 54.48,34.55 55.6,35.67 55.6,41.73 54.9,42.42 54.9,43.7 53.65,44.95 CON4.3
SCK
  Top 0.2: JP1.P$3 36.48,34.25 37.75,32.98 38.98,32.98 39.98,33.98 39.98,37.27 40.31,37.61 IC4.17
  Bottom 0.2: CON3.4 58.48,27.45 56.58,29.35 38.25,29.35 36.55,31.05 36.55,33.49 JP1.P$3
SUP  (via drill 0.3 pad 0.7)
  Top 0.4: JP1.P$2 34.92,38.47 34.92,41.45 v34.55,41.45 v35.15,41.45
  Top 0.5: D1.C 16.75,48.44 | D4.A 15.55,39.27 15.55,41.05 14.2,42.4 14.2,44.35 16.75,46.9 D1.C | Q2.1 18.55,36.45 18.55,37.5 R9.1 v17.65,37.5 | D3.C 17.75,48.8 | 17.75,48.8 D1.C | v17.75,50.75 17.75,48.8 | 51.42,51.05 LED5.A 51.37,47.1 | R1.1 51.37,47.1 | 51.37,47.1 52.23,47.1 53.11,47.99 CON4.4 | IC2.4 14.25,38.15 v15.55,38.15
  Top 0.6: 15.55,39.27 v15.55,38.15 C13.2
  Bottom 0.3: v17.65,37.5 16.2,37.5 v15.55,38.15
  Bottom 0.5: 17.75,50.1 v17.75,50.75 | v17.75,50.75 v17.75,50.15 | 29.35,50.75 v17.75,50.75 | LED5.A 49.07,53.35 31.95,53.35 29.35,50.75 | 35,41.45 v35.15,41.45 v34.55,41.45 34.55,42.67 33.38,43.85 v31.07,43.85 30.65,44.27 29.98,44.27 29.3,44.95 29.3,45.62 29.93,46.25 29.93,48.38 29.35,48.95 29.35,50.75
  other vias: 31.77,43.83
  pour Top (no thermals): 32,43.5 30.88,43.5 30.88,45.02 32,45.02
TXO  (via drill 0.3 pad 0.7)
  Top 0.2: MODULE3.3 48.9,33.2 48.9,34.83 48.52,35.2 v48.5,35.2 | IC4.31 48.95,43.9 49.1,44.05 49.1,44.4 49.6,44.9 51.85,44.9 52.15,45.2 52.15,45.8 53.08,46.73 54.38,46.73 55.1,46 55.1,44.21 CON4.2
  Bottom 0.2: v48.5,35.2 48.52,35.2 48.77,34.95 54.27,34.95 55.2,35.88 55.2,41.51 53.8,42.91 CON4.2
VBAT  (via drill 0.3 pad 0.7)
  Top 0.25: 50.7,31.15 50.98,31.43 50.98,34.85 52.17,36.05 52.88,36.05 | 52.88,36.05 R26.1 | 52.88,36.05 54.17,36.05 Q7.2
  Top 0.4: 16.65,36.2 Q2.2
  Top 0.5: IC3.3 16.65,42.55 | IC3.3 15.55,42.55 15.1,43 v15.1,43.25 15.1,44 15.55,44.45 IC3.1 | 17.52,39.27 D4.C 18.77,39.25 | 17.52,39.27 17.52,40.62 17.07,41.08 C15.1 16.85,41.42 16.85,42.55 IC3.3 | 21.15,38.55 21.15,35.9 L1.P$1 21.55,33.92 23.12,32.35 42.33,32.35 42.4,32.27 42.69,31.99 43.52,31.15 50.7,31.15 | 21.15,38.55 21.15,38.95 C3.P$2 | 21.15,38.55 21.12,38.58 21.12,39.02 | 17.52,39.27 16.65,38.4 16.65,36.2 | 16.77,36.2 Q2.2
  Bottom 0.2: SJ4.1 v20.1,39.05
  Bottom 0.5: TP4.P$1 v15.1,43.25
  other vias: 20.1,39.6
  pour Top (no thermals): 18.05,38.88 18.05,39.77 21.6,39.77 21.6,38.88
VDD_3V3  (via drill 0.3 pad 0.7)
  Top 0.2: 44.42,47.73 C9.1 44.98,47.95 44.98,48.38 45.27,48.67 45.92,48.67 | 43.27,47.95 C8.1 | 45.58,49.4 R20.1 45.92,48.67 | v46.55,42.92 46.45,42.83 44.6,42.83 44.17,43.25 44.17,46.12 IC4.4 | 45.92,48.67 46.52,48.67 46.85,48.35 46.85,47.92 R22.1 | R5.1 32.48,30.43 31.1,31.8 26.25,31.8 v24.7,30.25 | R4.2 51.6,42.2 50.95,41.55 v50.88,41.55
  Top 0.3: Q1.2 19.73,23.38 R15.1
  Top 0.4: 40.67,45.08 40.2,45.55 38.6,45.55 38.4,45.75
  Top 0.5: 19.95,44.45 C14.1 20.45,44.5 21.15,45.2 21.15,46.15 21.5,46.5 30.2,46.5 30.85,45.85 35.75,45.85 35.92,46.02 38.12,46.02 38.4,45.75 | 19.95,44.45 IC3.5 | 40.67,45.08 41.83,45.08 | 41.83,45.08 42.45,45.08 42.65,45.27 IC4.6 42.65,47.17 43.12,47.65 C8.1 44.25,47.92 | 44.25,47.92 C9.1 | 44.25,47.92 IC4.4 | IC4.18 41.85,45.05 41.83,45.08 | v16.85,30.23 v16.85,30.82 | v20.27,40.55 v19.68,40.55 19.95,40.55 19.95,44.45
  Top 0.8: Q1.2 19.5,23.7 18.12,25.07 18.12,28.75 16.85,30.02 v16.85,30.82
  Bottom 0.2: v46.55,42.92 46.55,42.5 47.6,41.45 47.6,41.05 47.8,40.85 49.8,40.85 50.5,41.55 v50.88,41.55 | 23.5,31.2 24.15,31.2 24.15,30.7 24.6,30.25 v24.7,30.25
  Bottom 0.5: v20.27,40.55 v19.68,40.55 19.2,40.55 18.55,39.9 18.55,36.85 15.93,34.23 15.93,31.75 v16.85,30.82 v16.85,30.23 TP6.P$1 | 23.5,31.3 SJ2.1 23.5,31.2 22.98,31.2 22.15,30.38 18.3,30.38 TP6.P$1 | TP6.P$1 18,30.23
VDD_5V  (via drill 0.3 pad 0.7)
  Top 0.3: C1.P$2 28.75,41 28.07,40.33 23.62,40.33 23.3,40 v23.3,39.65
  Top 0.5: IC1.2 28.35,34.34 | 28.35,34.34 28.35,36 29.35,37 | 29.35,37 C2.P$2 29.35,40.75 C1.P$2 | D2.C 29.35,37 | 28.35,34.34 v28.35,33.92 v28.35,33.33 | v23.3,39.65 v23.3,39.1
  Bottom 0.3: SJ3.1 23.3,39.4 v23.3,39.65
  Bottom 0.5: SJ1.1 26.9,31.75 27.35,32.2 28.35,32.2 | v28.35,33.92 28.35,32.2 | TP3.P$1 CON3.1 CON3.2 56.65,24.05 56.65,27.77 56.12,28.3 37.9,28.3 35.9,30.3 33.6,30.3 31.7,32.2 28.35,32.2

### Text on the board
Bottom: CCO v3.2
tPlace: CON77
bPlace: GND | VDD | RX | BUZZER | TX | DTR | BAT | 5V | GND | GND | 5V | A7 | 3.3V | MOSI | SCK | MISO | 5V | 5V